# EAGLE design DMG_Control_Panel (EAGLE 7.5.0)
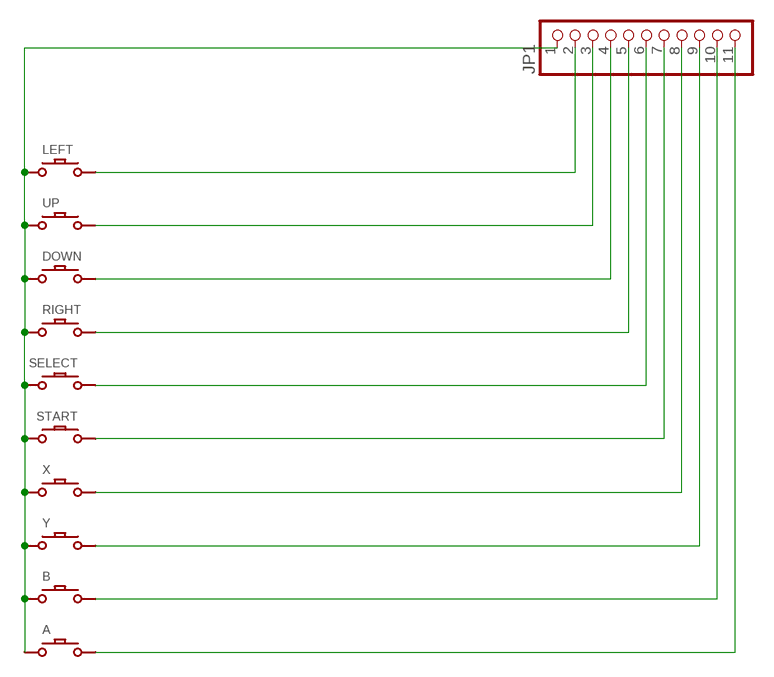
[diagram p0: schematic, sheet 1]

## Parts
A  DMG-BTN  DMG-BTNREGULAR  [DMG-BTN]
B  DMG-BTN  DMG-BTNREGULAR  [DMG-BTN]
DOWN  DMG-BTN  DMG-BTNREGULAR  [DMG-BTN]
JP1  PINHD-1X11M  [1X11M]
LEFT  DMG-BTN  DMG-BTNREGULAR  [DMG-BTN]
RIGHT  DMG-BTN  DMG-BTNREGULAR  [DMG-BTN]
SELECT  DMG-BTN  DMG-BTNSELECT  [DMG-SEL]
START  DMG-BTN  DMG-BTNSELECT  [DMG-SEL]
UP  DMG-BTN  DMG-BTNREGULAR  [DMG-BTN]
X  DMG-BTN  DMG-BTNREGULAR  [DMG-BTN]
Y  DMG-BTN  DMG-BTNREGULAR  [DMG-BTN]

## Nets
GND: A.P$1 B.P$1 DOWN.P$1 JP1.1 LEFT.P$1 RIGHT.P$1 SELECT.P$2 START.P$2 UP.P$1 X.P$1 Y.P$1
N$1: JP1.2 LEFT.P$2
N$2: JP1.3 UP.P$2
N$3: DOWN.P$2 JP1.4
N$4: JP1.5 RIGHT.P$2
N$5: JP1.6 SELECT.P$1
N$6: JP1.7 START.P$1
N$7: JP1.8 X.P$2
N$8: JP1.9 Y.P$2
N$9: B.P$2 JP1.10
N$10: A.P$2 JP1.11

## Library data of the parts
A B DOWN LEFT RIGHT SELECT START UP X Y = Game Boy:DMG-BTN
JP1 = pinhead:PINHD-1X11: PIN HEADER

## Board
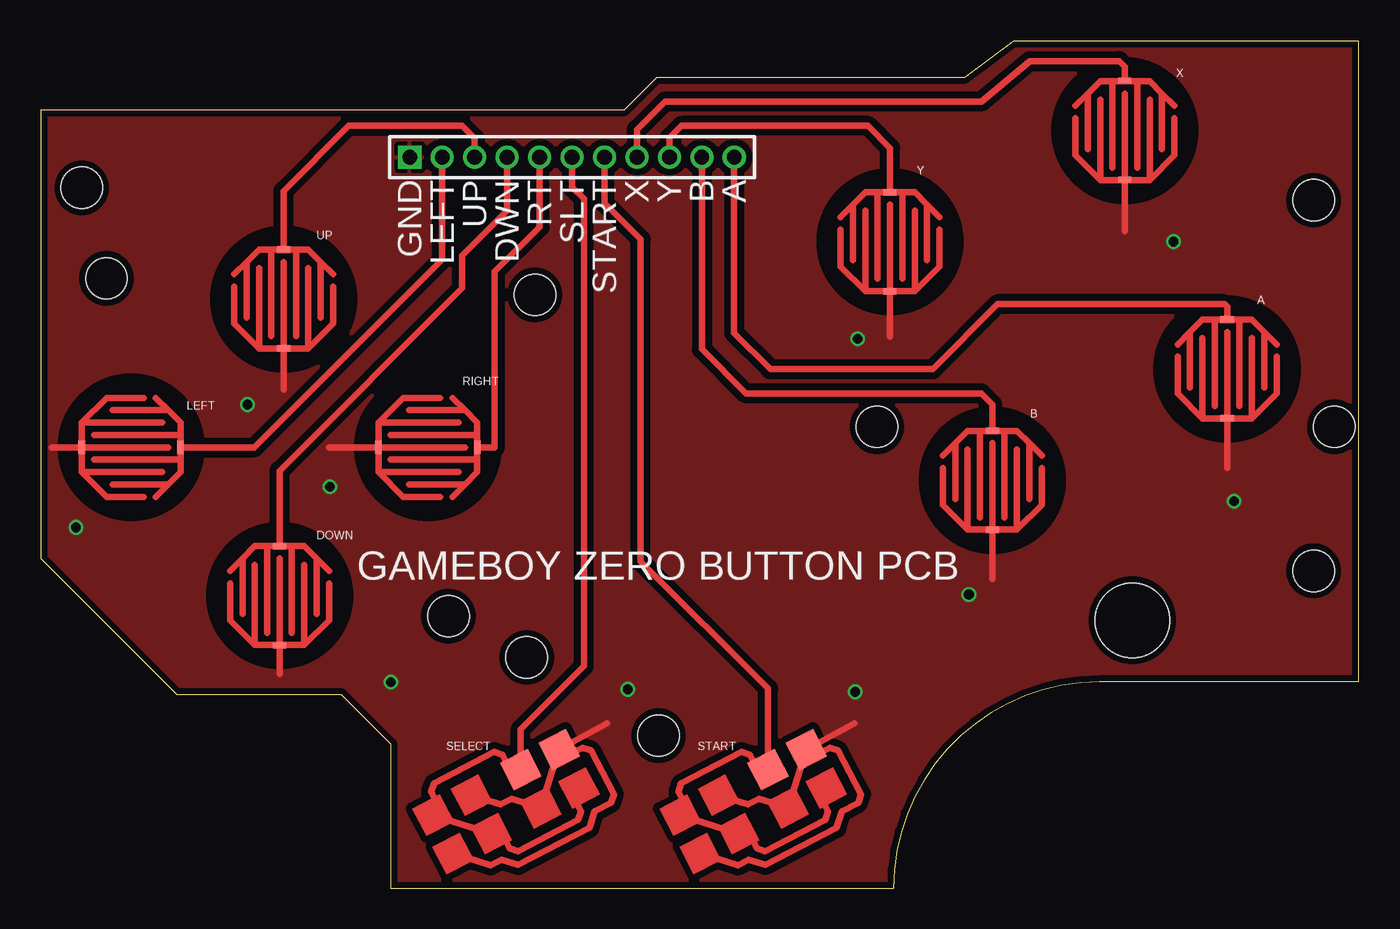
[diagram p1: board, top side]
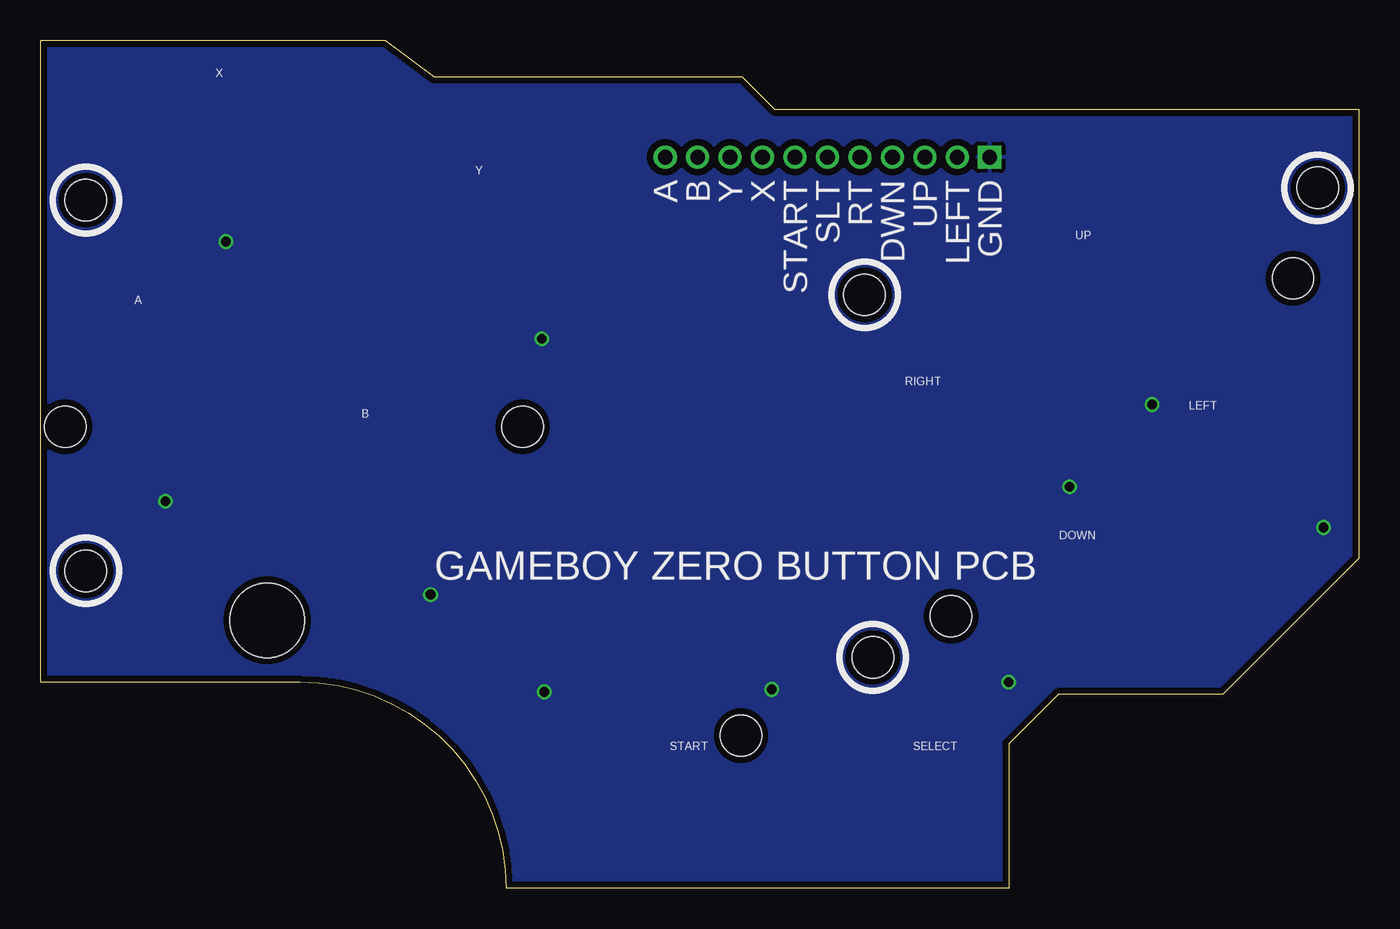
[diagram p2: board, bottom side, seen from below]

Size 81.28 x 52.26 mm. Coordinates in mm from the lower left corner, seen from the top.
Outline: 0,20.32 8.38,11.94 18.54,11.94 21.59,8.89 21.59,0 52.58,0 arc-90 65.28,12.7 81.28,12.7 81.28,52.26 60,52.26 57,50 38,50 36,48 0,48 0,20.32
Copper layers (1*16): Top 0.035mm / dielectric 1.5mm / Bottom 0.035mm
Design rules "ITEADstudio_DRC": minimum track width 6mil, minimum drill 12mil, track to track 6mil, track to pad 6mil, pad to pad 6mil, via to via 6mil, smd to smd 0mil, copper to edge 10mil, drill to drill 10mil, minimum pad ring 10mil, minimum via ring 6mil, stop-mask expansion 2mil, vias tented up to drill 100mil, thermal gap 10mil
Holes 4.57 mm at 67.31,16.51
Holes 2.54 mm at 2.54,43.18 78.49,42.42 78.49,19.56 30.48,36.58 29.97,14.22 51.56,28.45 25.15,16.76 38.1,9.4 79.76,28.45 4.06,37.59

### Footprints (pad centres in the part's own frame; a part is rotated, then mirrored left to right if it is on the bottom)
DMG-BTN = smd 0.813 x 0.406: P$1 0,-3.048; P$2 0,3.048
1X11M = drill 0.914 square: 1 -10,0 | drill 0.914: 2 -8,0; 3 -6,0; 4 -4,0; 5 -2,0; 6 0,0; 7 2,0; 8 4,0; 9 6,0; 10 8,0; 11 10,0
DMG-SEL = smd 1.905 x 1.905: P$1 1.714,1.333; P$2 4.381,1.333

### Placement (x,y rotation side)
A  73.15,32 0 top
B  58.67,25.15 0 top
DOWN  14.73,18.03 0 top
JP1  32.77,45.07 0 top
LEFT  5.59,27.18 270 top
RIGHT  23.88,27.18 270 top
SELECT  28.7,5.33 27.5 top
START  43.94,5.33 27.5 top
UP  14.99,36.32 0 top
X  66.85,46.71 0 top
Y  52.37,39.85 0 top

### Tracks (layer width: path | path; a pad name or v marks a point on that pad's centre or on a via)
GND  (via drill 0.6)
  Top 0.406: DOWN.P$1 14.73,13.2 | RIGHT.P$1 17.78,27.18 | UP.P$1 14.99,30.73 | SELECT.P$2 34.92,10.16 | START.P$2 50.16,10.16 | LEFT.P$1 0.7,27.18 | 57.15,22.1 B.P$1 58.67,19.05 | A.P$1 73.15,25.9 | Y.P$1 52.37,34 | X.P$1 66.85,40.5
  other vias: 2.19,22.24 36.2,12.25 17.83,24.74 57.23,18.1 21.59,12.7 73.58,23.86 12.75,29.82 50.37,33.86 69.85,39.86 50.23,12.1
  pour Bottom (isolate 0.406): 0,52.26 81.28,52.26 81.28,12.7 65.28,12.7 arc90 52.58,0 21.59,0 21.59,8.89 18.54,11.94 8.38,11.94 0,20.32
  pour Top (isolate 0.406): 0,52.26 81.28,52.26 81.28,12.7 65.28,12.7 arc90 52.58,0 21.59,0 21.59,8.89 18.54,11.94 8.38,11.94 0,20.32
N$1
  Top 0.406: JP1.2 24.77,38.77 13.18,27.18 LEFT.P$2
N$2
  Top 0.406: UP.P$2 14.99,42.99 19,47 26,47 26.77,46.23 JP1.3
N$3
  Top 0.406: JP1.4 28.77,41.77 26,39 26,37 14.73,25.73 DOWN.P$2
N$4
  Top 0.406: JP1.5 30.77,40.77 28,38 28,27.18 RIGHT.P$2
N$5
  Top 0.406: SELECT.P$1 29.61,9.79 33.5,13.69 33.5,42.5 32.77,43.23 JP1.6
N$6
  Top 0.406: START.P$1 44.85,12.3 37,20.15 37,40 34.77,42.23 JP1.7
N$7
  Top 0.406: X.P$2 66.85,50.65 66.5,51 61,51 58,48.5 38.5,48.5 36.77,46.77 JP1.8
N$8
  Top 0.406: Y.P$2 52.37,45.63 51,47 39.5,47 38.77,46.27 JP1.9
N$9
  Top 0.406: B.P$2 58.67,29.83 58,30.5 43.5,30.5 40.77,33.23 JP1.10
N$10
  Top 0.406: A.P$2 73.15,35.85 73,36 59,36 55,32 45,32 42.77,34.23 JP1.11

### Text on the board
tNames: X | GND | LEFT | UP | DWN | RT | SLT | START | X | Y | B | A | Y | UP | A | RIGHT | LEFT | B | DOWN | GAMEBOY ZERO BUTTON PCB | SELECT | START
bNames: X | GND | LEFT | UP | DWN | RT | SLT | START | X | Y | B | A | Y | UP | A | RIGHT | LEFT | B | DOWN | GAMEBOY ZERO BUTTON PCB | SELECT | START